# EAGLE design speaker (EAGLE 7.7.0)
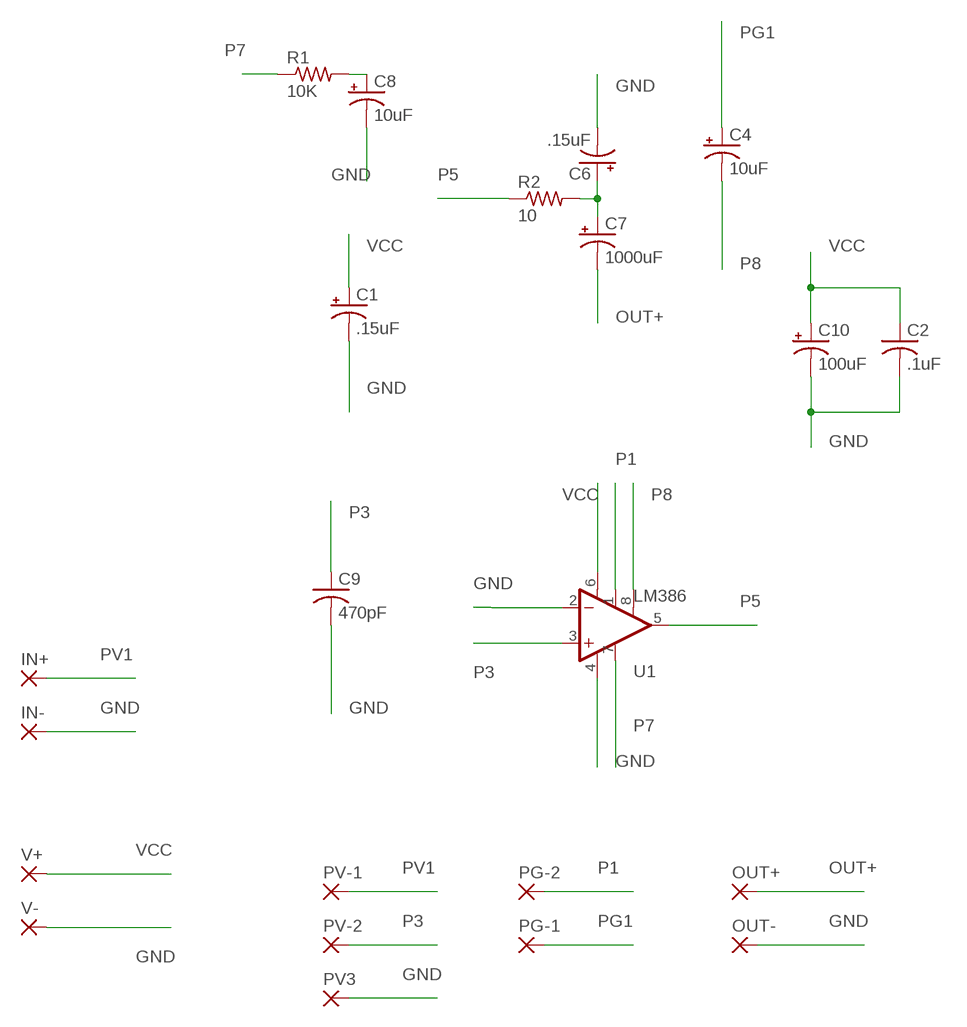
[diagram p0: schematic, sheet 1]

## Parts
C1  .15uF  CPOL-USB45181A  [B45181A]
C2  .1uF  C-US025-024X044  [C025-024X044]
C4  10uF  CPOL-USE3.5-4  [E3,5-4]
C6  .15uF  CPOL-USB45181A  [B45181A]
C7  1000uF  CPOL-USE5-10.5  [E5-10,5]
C8  10uF  CPOL-USE1.8-4  [E1,8-4]
C9  470pF  C-US050-025X075  [C050-025X075]
C10  100uF  CPOL-USE2-5  [E2-5]
IN+  2,54/1,0  [2,54/1,0]
IN-  2,54/1,0  [2,54/1,0]
OUT+  2,54/1,0  [2,54/1,0]
OUT-  2,54/1,0  [2,54/1,0]
PG-1  2,54/1,0  [2,54/1,0]
PG-2  2,54/1,0  [2,54/1,0]
PV3  2,54/1,0  [2,54/1,0]
PV-1  2,54/1,0  [2,54/1,0]
PV-2  2,54/1,0  [2,54/1,0]
R1  10K  R-US_0207/7  [0207/7]
R2  10  R-US_0207/7  [0207/7]
U1  LM386  [DIP08]
V+  2,54/1,0  [2,54/1,0]
V-  2,54/1,0  [2,54/1,0]

## Nets
GND: C1.- C2.2 C6.- C8.- C9.2 C10.- IN-.1(P) OUT-.1(P) PV3.1(P) U1.2(-IN) U1.4(V-) V-.1(P)
N$1: C6.+ C7.+ R2.2
N$4: C8.+ R1.2
OUT+: C7.- OUT+.1(P)
P1: PG-2.1(P) U1.1(GAIN)
P3: C9.1 PV-2.1(P) U1.3(+IN)
P5: R2.1 U1.5(OUT)
P7: R1.1 U1.7(BP)
P8: C4.- U1.8(GAIN)
PG1: C4.+ PG-1.1(P)
PV1: IN+.1(P) PV-1.1(P)
VCC: C1.+ C2.1 C10.+ U1.6(V+) V+.1(P)

## Library data of the parts
C1 C4 C6-C8 C10 = adafruit:CPOL-US: POLARIZED CAPACITOR, American symbol
C2 C9 = adafruit:C-US: CAPACITOR, American symbol
IN+ IN- OUT+ OUT- PG-1 PG-2 PV3 PV-1 PV-2 V+ V- = wirepad:2,54/1,0: THROUGH-HOLE PAD
R1 R2 = resistor:R-US_: RESISTOR, American symbol
U1 = SparkFun-AnalogIC:LM386: low voltage audio power amplifier

## Board
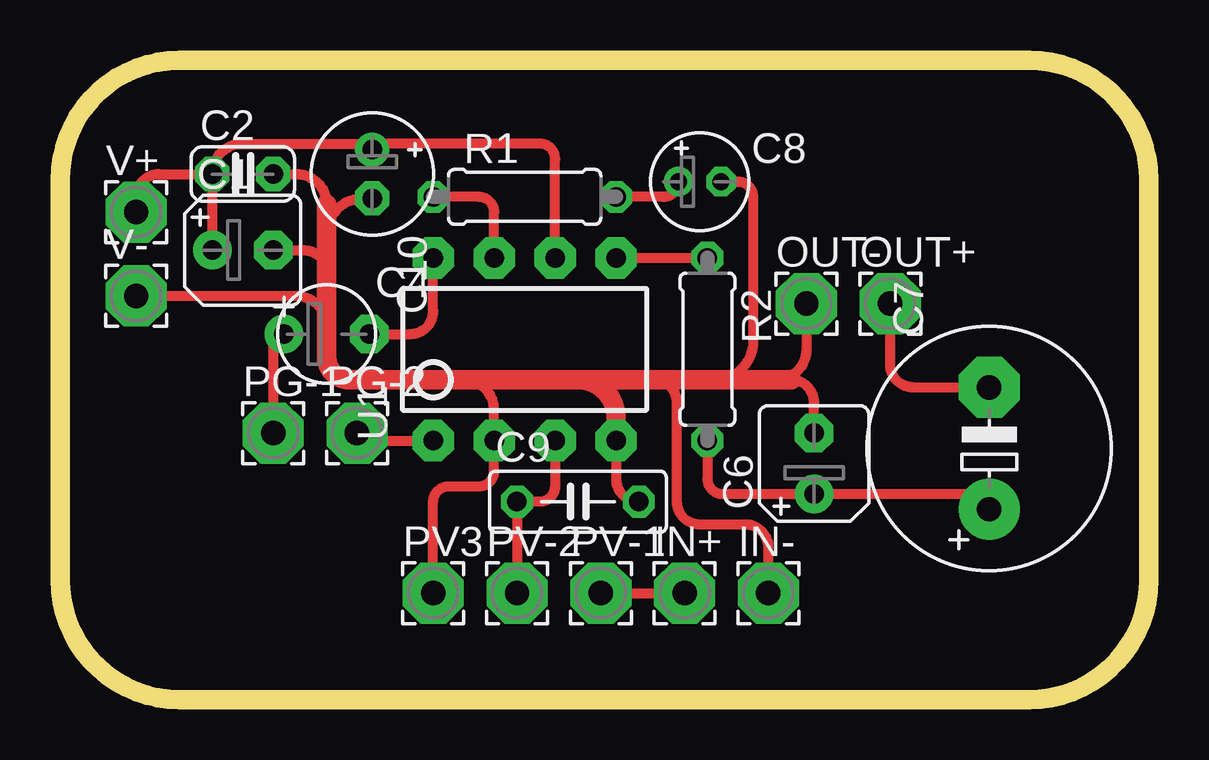
[diagram p1: board, top side]
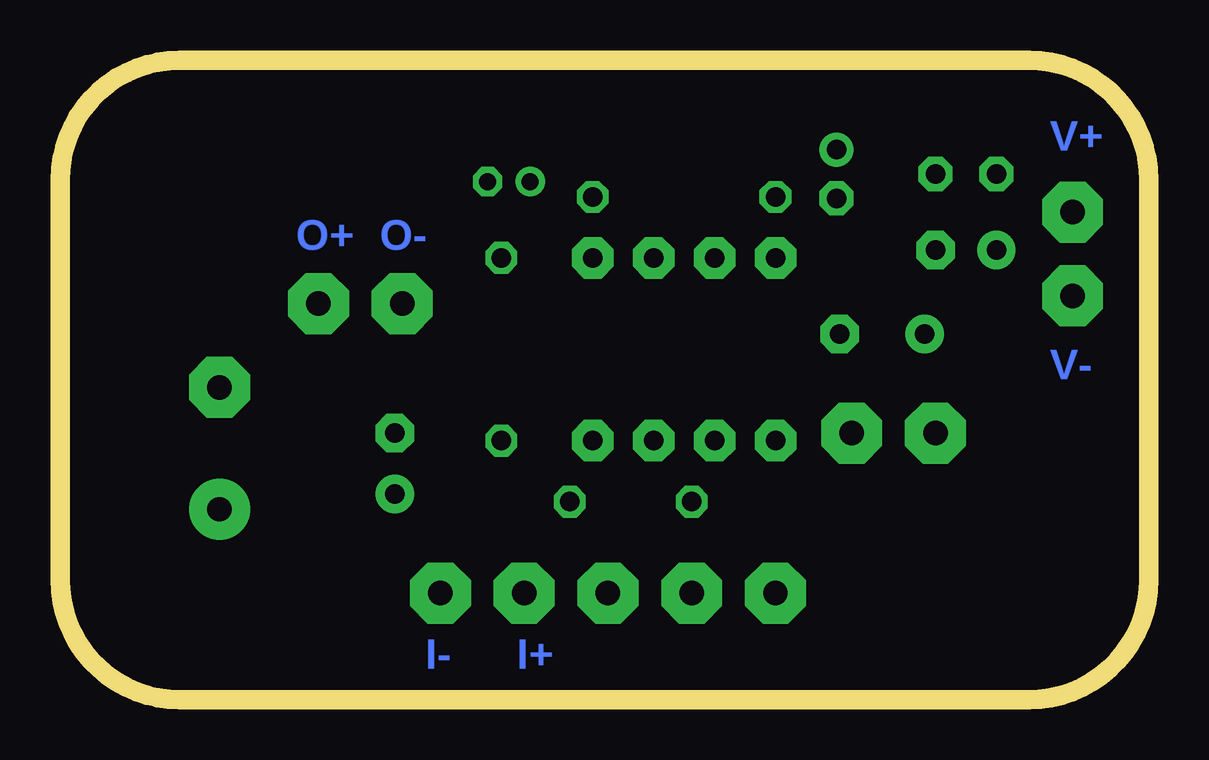
[diagram p2: board, bottom side, seen from below]

Size 45.38 x 26.66 mm. Coordinates in mm from the lower left corner, seen from the top.
Outline: 0,21.66 0,5 arc90 5,0 40.38,0 arc90 45.38,5 45.38,21.66 arc90 40.38,26.66 5,26.66 arc90 0,21.66
Copper layers (1*16): Top 0.035mm / dielectric 1.5mm / Bottom 0.035mm
Design rules "default": minimum track width 10mil, minimum drill 24mil, track to track 8mil, track to pad 8mil, pad to pad 8mil, via to via 8mil, smd to smd 8mil, copper to edge 40mil, drill to drill 8mil, minimum pad ring 10mil, minimum via ring 8mil, stop-mask expansion 4mil, vias tented up to drill 0mil, thermal gap 10mil

### Footprints (pad centres in the part's own frame; a part is rotated, then mirrored left to right if it is on the bottom)
B45181A = drill 0.813 pad 1.6: + -1.27,0 | drill 0.813 pad 1.6 octagon: - 1.27,0
C025-024X044 = drill 0.813 pad 1.422 octagon: 1 -1.27,0; 2 1.27,0
E3,5-4 = drill 0.813 pad 1.6: + -1.778,0 | drill 0.813 pad 1.6 octagon: - 1.778,0
E5-10,5 = drill 1.016 pad 2.54: + -2.54,0 | drill 1.016 pad 2.54 octagon: - 2.54,0
E1,8-4 = drill 0.711 pad 1.168: + -0.889,0 | drill 0.711 pad 1.168 octagon: - 0.889,0
C050-025X075 = drill 0.813 octagon: 1 -2.54,0; 2 2.54,0
E2-5 = drill 0.813 pad 1.422: + -1.016,0 | drill 0.813 pad 1.422 octagon: - 1.016,0
2,54/1,0 = drill 1.016 pad 2.54 octagon: 1 0,0
0207/7 = drill 0.813 octagon: 1 -3.81,0; 2 3.81,0
DIP08 = drill 0.813 pad 1.727 octagon: 1 -3.81,-3.81; 2 -1.27,-3.81; 3 1.27,-3.81; 4 3.81,-3.81; 5 3.81,3.81; 6 1.27,3.81; 7 -1.27,3.81; 8 -3.81,3.81

### Placement (x,y rotation side)
C1  7.62,18.73 0 top
C2  7.62,21.91 0 top
C4  11.11,15.24 0 top
C6  31.43,9.84 90 top
C7  38.73,10.48 90 top
C8  26.67,21.59 0 top
C9  21.59,8.26 0 top
C10  13.02,21.91 270 top
IN+  26.04,4.45 0 top
IN-  29.53,4.45 0 top
OUT+  34.61,16.51 0 top
OUT-  31.11,16.51 0 top
PG-1  8.89,11.11 0 top
PG-2  12.38,11.11 0 top
PV3  15.56,4.45 0 top
PV-1  22.54,4.45 0 top
PV-2  19.05,4.45 0 top
R1  19.37,20.95 0 top
R2  26.99,14.61 270 top
U1  19.37,14.61 0 top
V+  3.17,20.32 0 top
V-  3.17,16.83 0 top

### Tracks (layer width: path | path; a pad name or v marks a point on that pad's centre or on a via)
GND
  Top 0.406: U1.4 23.18,9.21 arc90 C9.2 | IN-.1 29.53,6.35 arc90 28.57,7.3 26.67,7.3 arc-90 25.72,8.26 25.72,12.38 arc90 24.77,13.34 | PV3.1 15.56,8.26 arc-90 16.19,8.89 17.46,8.89 arc90 18.1,9.53 U1.2 18.1,12.06 arc90 16.83,13.34 | C6.- 31.43,12.38 arc90 30.48,13.34 | OUT-.1 31.11,14.61 arc-90 29.84,13.34 | V-.1 9.84,16.83 arc-90 11.11,15.56 | C1.- 10.16,18.73 arc-90 11.11,17.78 | C2.2 9.84,21.91 arc-90 11.11,20.64 | C10.- 12.64,20.89 arc90 11.11,19.37 | C8.- 28.26,21.59 arc-90 28.89,20.95 28.89,14.92 arc-90 27.3,13.34
  Top 0.813: 21.59,13.34 24.77,13.34 27.3,13.34 29.84,13.34 30.48,13.34 | 21.59,13.34 16.83,13.34 12.06,13.34 arc-90 11.11,14.29 11.11,15.56 11.11,17.78 11.11,19.37 11.11,20.64 | U1.4 23.18,11.75 arc90 21.59,13.34
N$1
  Top 0.406: R2.2 26.99,9.21 arc90 27.62,8.57 C6.+ 38.1,8.57 arc-90 C7.+
N$4
  Top 0.406: C8.+ arc-90 25.15,20.95 R1.2
OUT+
  Top 0.406: OUT+.1 34.61,13.97 arc90 35.56,13.02 C7.-
P1
  Top 0.406: PG-2.1 arc90 12.7,10.79 U1.1
P3
  Top 0.406: U1.3 20.64,8.89 arc-90 20,8.26 C9.1 PV-2.1
P5
  Top 0.406: U1.5 R2.1
P7
  Top 0.406: U1.7 18.1,20.32 arc90 17.46,20.95 R1.1
P8
  Top 0.406: C4.- 14.61,15.24 arc90 15.56,16.19 U1.8
PG1
  Top 0.406: C4.+ arc90 8.89,14.8 PG-1.1
PV1
  Top 0.406: PV-1.1 IN+.1
VCC
  Top 0.406: V+.1 3.17,20.95 arc-90 4.13,21.91 C2.1 | C2.1 C1.+ | C2.1 arc-90 7.62,23.18 12.76,23.18 | 12.76,23.18 arc-90 C10.+ | U1.6 20.64,22.54 arc90 20,23.18 12.76,23.18

### Text on the board
Bottom: V+ | O- | O+ | V- | I+ | I-